# EAGLE design Painel_V1.0.4 (EAGLE 8.2.2)
CNAME: SimulaCare; CREVISION: 1.0.4; DESIGNER: Rinaldo
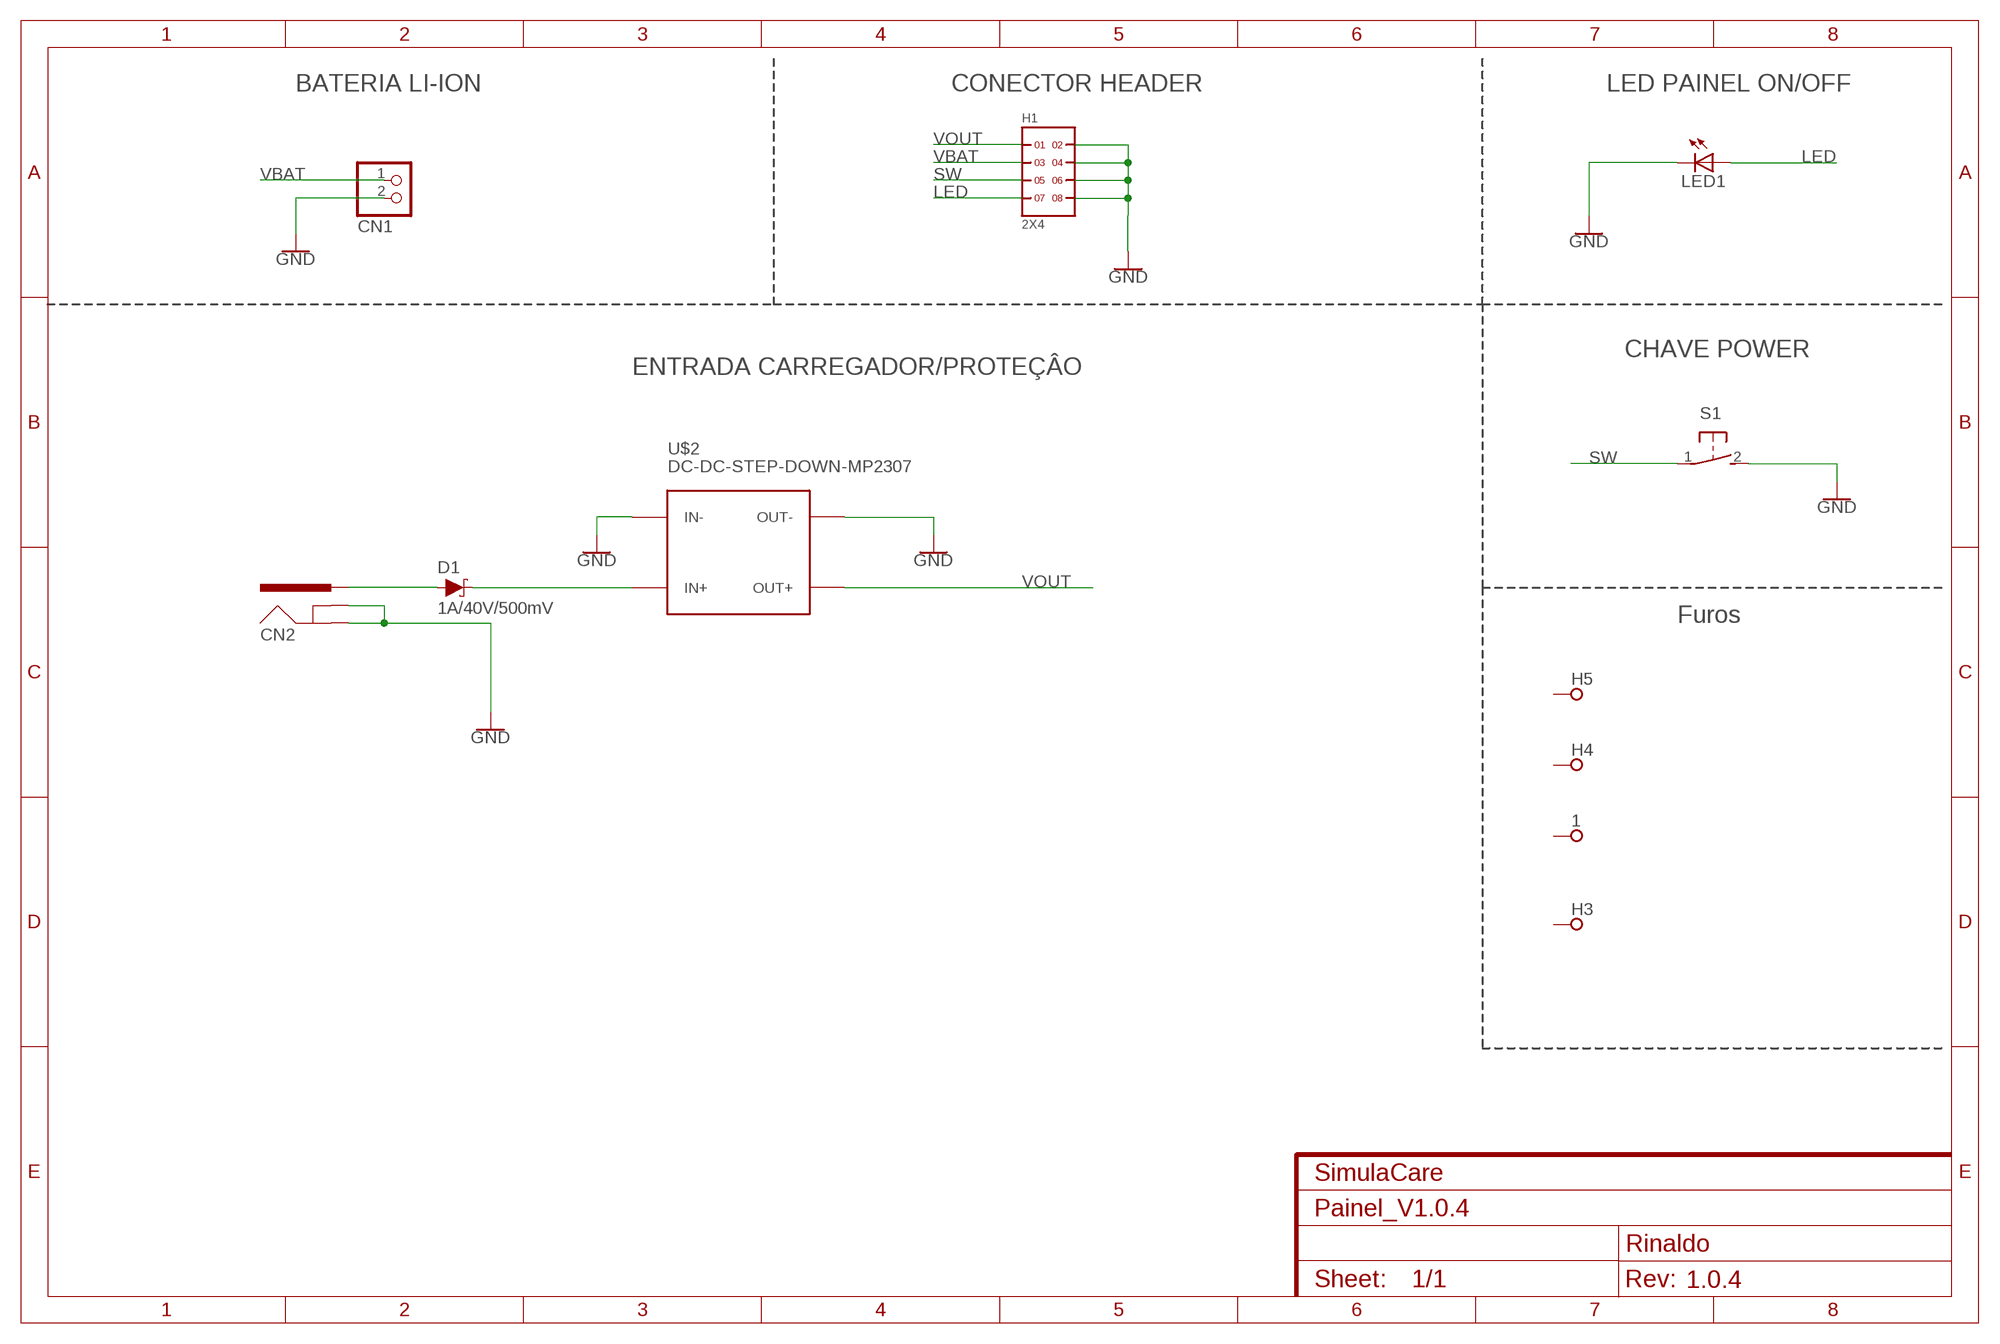
[diagram p0: schematic, sheet 1]

## Parts
1  SPECIAL_DRILL_0.1250  [PAD_0.1250]
CN1  JST_2PIN-THM  [JST-PH-2-THM]
CN2  POWERJACK  [POWERJACK]
D1  1A/40V/500mV  DIODE-SCHOTTKY-SS14  [SMA-DIODE]
H1  2X4  [2X4]
H3  SPECIAL_DRILL_0.1250  [PAD_0.1250]
H4  SPECIAL_DRILL_0.1250  [PAD_0.1250]
H5  SPECIAL_DRILL_0.1250  [PAD_0.1250]
LED1  LED3MM  [LED3MM]
S1  31-XX  [B3F-31XX]
U$2  DC-DC-STEP-DOWN-MP2307  [DC-DC-STEP-DOWN-MP2307]

## Nets
GND: CN1.2 CN2.GND CN2.GNDBREAK H1.2 H1.4 H1.6 H1.8 LED1.K(C) S1.2(S) U$2.IN- U$2.OUT-
LED: H1.7 LED1.A
N$1: CN2.PWR D1.A
N$2: D1.C U$2.IN+
SW: H1.5 S1.1(P)
VBAT: CN1.1 H1.3
VOUT: H1.1 U$2.OUT+
Unconnected: 1.1 H3.1 H4.1 H5.1

## Notes on the sheet
- BATERIA LI-ION | CONECTOR HEADER | LED PAINEL ON/OFF
- CHAVE POWER
- ENTRADA CARREGADOR/PROTEÇÂO
- Furos

## Library data of the parts
1 H3-H5 = special-drill:SPECIAL_DRILL_: Special drills
CN1 = adafruit:JST_2PIN: JST 2-Pin Connectors of various flavors SMT-RA (S2B-PH-SM4) 4UConnector #17311 SMT (B2B-PH-SM4) THM-RA (S2B-PH) THM (B2B-PH)
CN2 = mbr0520:POWERJACK: Power Jack Standard 2.1 mm * 5.5 mm barrel jack for power (e.g. Arduino).
D1 = SparkFun-DiscreteSemi:DIODE-SCHOTTKY: Schottky diode A Schottky diode is a semiconductor diode which has a low forward voltage drop and a very fast switching action.; PROD_ID: DIO-08053
H1 = headers(.1in):2X4
LED1 = adafruit:LED: LED OSRAM: - CHIPLED LG R971, LG N971, LY N971, LG Q971, LY Q971, LO R971, LY R971 LH N974, LH R974 LS Q976, LO Q976, LY Q976 LO Q996 - Hyper CHIPLED LW Q18S LB Q993, LB Q99A, LB R99A - SideLED LS A670, LO A670, LY A670, LG A670, LP A670 LB A673, LV A673, LT A673, LW A673 LH A674 LY A675 LS A676, LA A676, LO A676, LY A676, LW A676 LS A679, LY A679, LG A679 - Hyper Micro SIDELED® LS Y876, LA Y876, LO Y876, LY Y876 LT Y87S - SmartLED LW L88C, LW L88S LB L89C, LB L89S, LG L890 LS L89K, LO L89K, LY L89K LS L896, LA L896, LO L896, LY L896 - TOPLED LS T670, LO T670, LY T670, LG T670, LP T670 LSG T670, LSP T670, LSY T670, LOP T670, LYG T670 LG T671, LOG T671, LSG T671 LB T673, LV T673, LT T673, LW T673 LH T674 LS T676, LA T676, LO T676, LY T676, LB T676, LH T676, LSB T676, LW T676 LB T67C, LV T67C, LT T67C, LS T67K, LO T67K, LY T67K, LW E67C LS E67B, LA E67B, LO E67B, LY E67B, LB E67C, LV E67C, LT E67C LW T67C LS T679, LY T679, LG T679 LS T770, LO T770, LY T770, LG T770, LP T770 LB T773, LV T773, LT T773, LW T773 LH T774 LS E675, LA E675, LY E675, LS T675 LS T776, LA T776, LO T776, LY T776, LB T776 LHGB T686 LT T68C, LB T68C - Hyper Mini TOPLED® LB M676 - Mini TOPLED Santana® LG M470 LS M47K, LO M47K, LY M47K Source: http://www.osram.convergy.de/
S1 = adafruit:31-XX: OMRON SWITCH Now with beefier pads!
U$2 = diy-modules:DC-DC-STEP-DOWN-MP2307: DC/DC Step-Down Regulator based on MP2307DN chip MP2307 datasheet available here: https://cdn-shop.adafruit.com/datasheets/MP2307_r1.9.pdf Click here to find device on ebay.com <http://www.ebay.com/sch/dc+dc+3a+mini+converter>

## Board
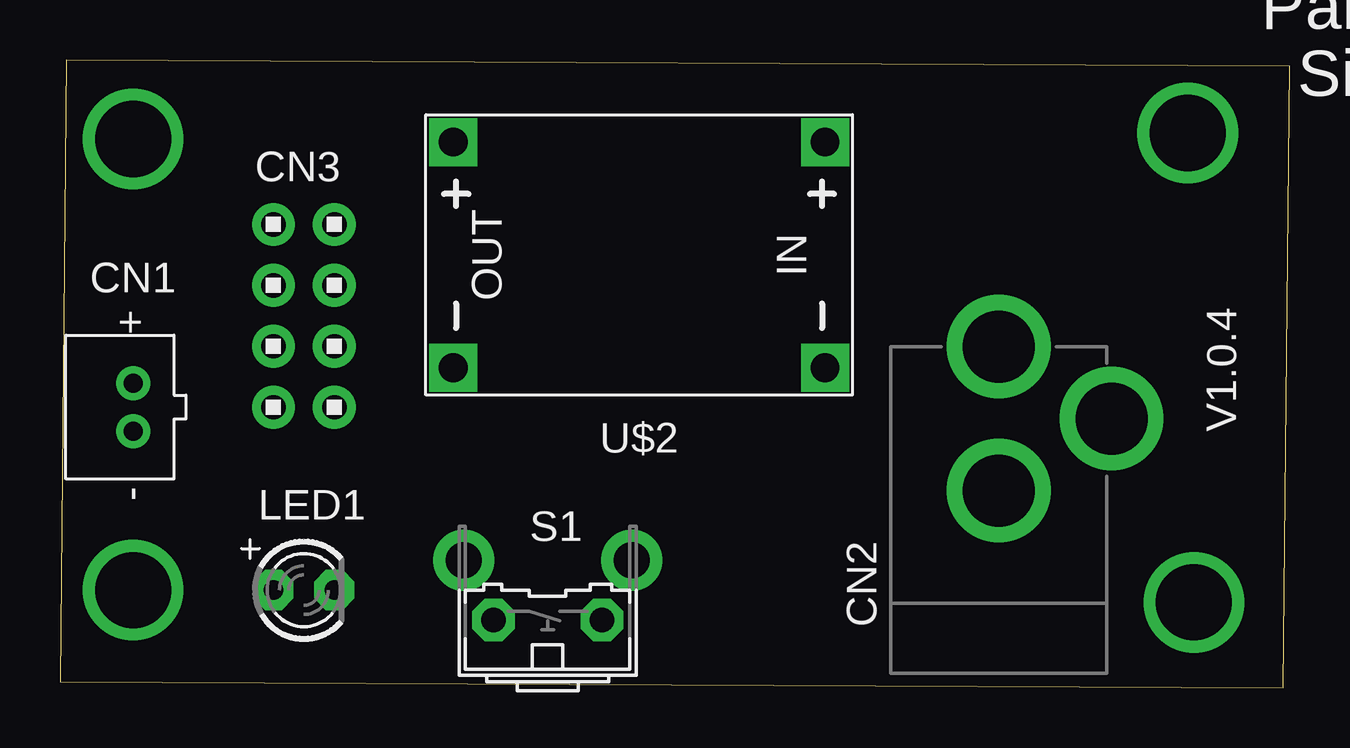
[diagram p1: board, top side]
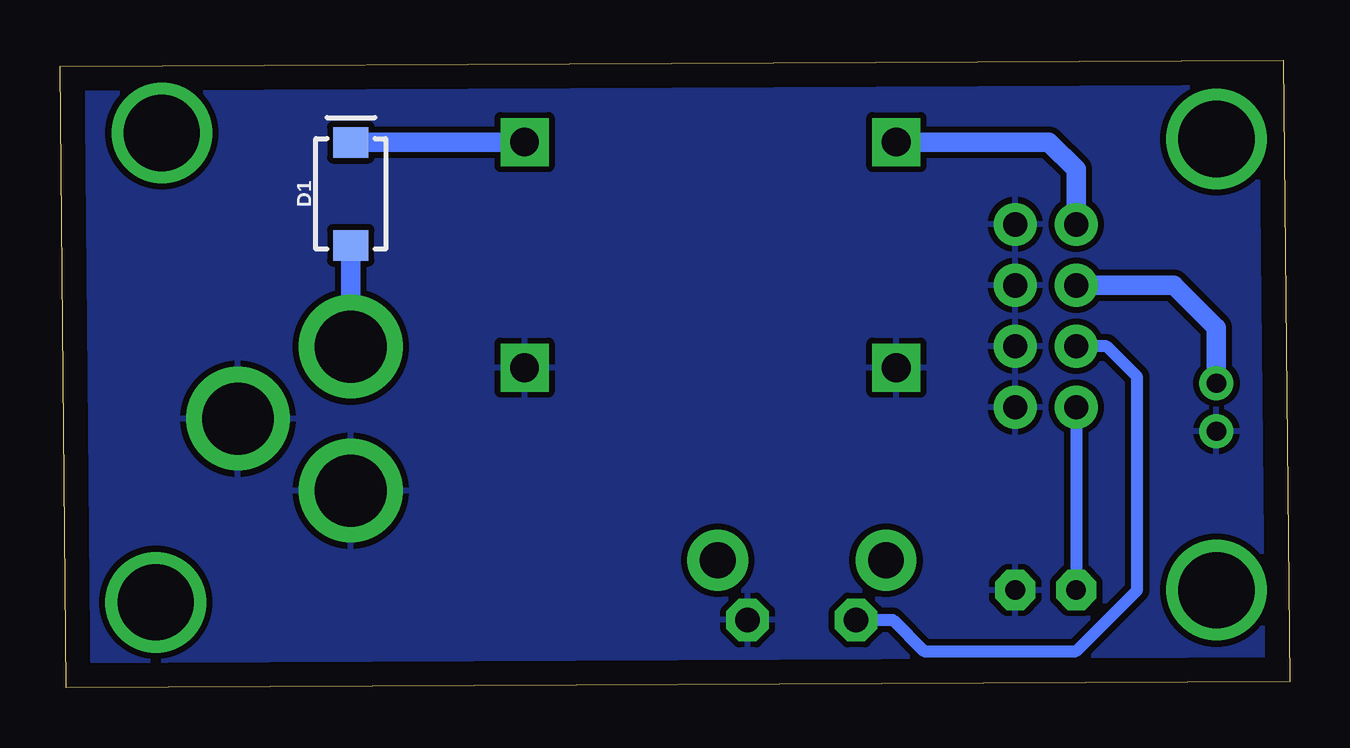
[diagram p2: board, bottom side, seen from below]

Size 51.23 x 26.15 mm. Coordinates in mm from the lower left corner, seen from the top.
Outline: 0,0.25 50.98,0 51.23,25.9 0.25,26.15 0,0.25
Copper layers (1*16): Top 0.035mm / dielectric 1.5mm / Bottom 0.035mm
Design rules "default *": minimum track width 8mil, minimum drill 0.5mm, track to track 10mil, track to pad 10mil, pad to pad 10mil, via to via 10mil, smd to smd 10mil, copper to edge 40mil, drill to drill 8mil, minimum pad ring 10mil, minimum via ring 8mil, stop-mask expansion 4mil, vias tented up to drill 0mil, thermal gap 10mil

### Footprints (pad centres in the part's own frame; a part is rotated, then mirrored left to right if it is on the bottom)
PAD_0.1250 = drill 3.175 pad 3.175: 1 0,0
JST-PH-2-THM = drill 0.8 pad 1.422: 1 1,0; 2 -1,0
POWERJACK = drill 2.997 pad 4.318: GND 0,7.7; GNDBREAK 4.7,10.7; PWR 0,13.7
SMA-DIODE = smd 1.27 x 1.47: A -2.15,0; C 2.15,0
2X4 = drill 1.016 pad 1.778: 1 0,0; 2 0,2.54; 3 2.54,0; 4 2.54,2.54; 5 5.08,0; 6 5.08,2.54; 7 7.62,0; 8 7.62,2.54
LED3MM = drill 0.813 pad 1.676 octagon: A -1.27,0; K 1.27,0
B3F-31XX = drill 1.016 pad 1.778 octagon: 1 -2.261,-1.245; 2 2.261,-1.245 | drill 1.499 pad 2.54: 3 -3.505,1.245; 4 3.505,1.245
DC-DC-STEP-DOWN-MP2307 = drill 1.2 pad 2 square: IN+ -7.747,-4.699; IN- -7.747,4.699; OUT+ 7.747,-4.699; OUT- 7.747,4.699

### Placement (x,y rotation side)
1  3.05,22.86 0 top
CN1  3.05,11.68 90 top
CN2  39.12,0.51 0 top
D1  39.12,20.57 90 bottom
H1  8.89,19.3 270 top
H3  46.99,23.11 0 top
H4  47.24,3.56 0 top
H5  3.05,4.06 0 top
LED1  10.16,4.06 0 top
S1  20.32,4.06 0 top
U$1  [ROHS_LOGO_0.18_IN]  53.59,18.29 0 top
U$2  24.13,18.03 180 top

### Tracks (layer width: path | path; a pad name or v marks a point on that pad's centre or on a via)
GND
  pour Bottom: 0.25,26.16 51.05,25.65 51.05,-0.25 0.25,0.25
LED
  Bottom 0.508: H1.7 LED1.A
N$1
  Bottom 0.813: D1.A CN2.PWR
N$2
  Bottom 0.813: D1.C U$2.IN+
SW
  Bottom 0.508: S1.1 16.54,2.82 15.24,1.52 8.89,1.52 6.35,4.06 6.35,12.95 7.62,14.22 H1.5
VBAT
  Bottom 0.813: H1.3 4.83,16.76 3.05,14.99 CN1.1
VOUT
  Bottom 0.813: U$2.OUT+ 10.03,22.73 8.89,21.59 H1.1

### Text on the board
tPlace: Painel | SimulaCare | CN3 | V1.0.4